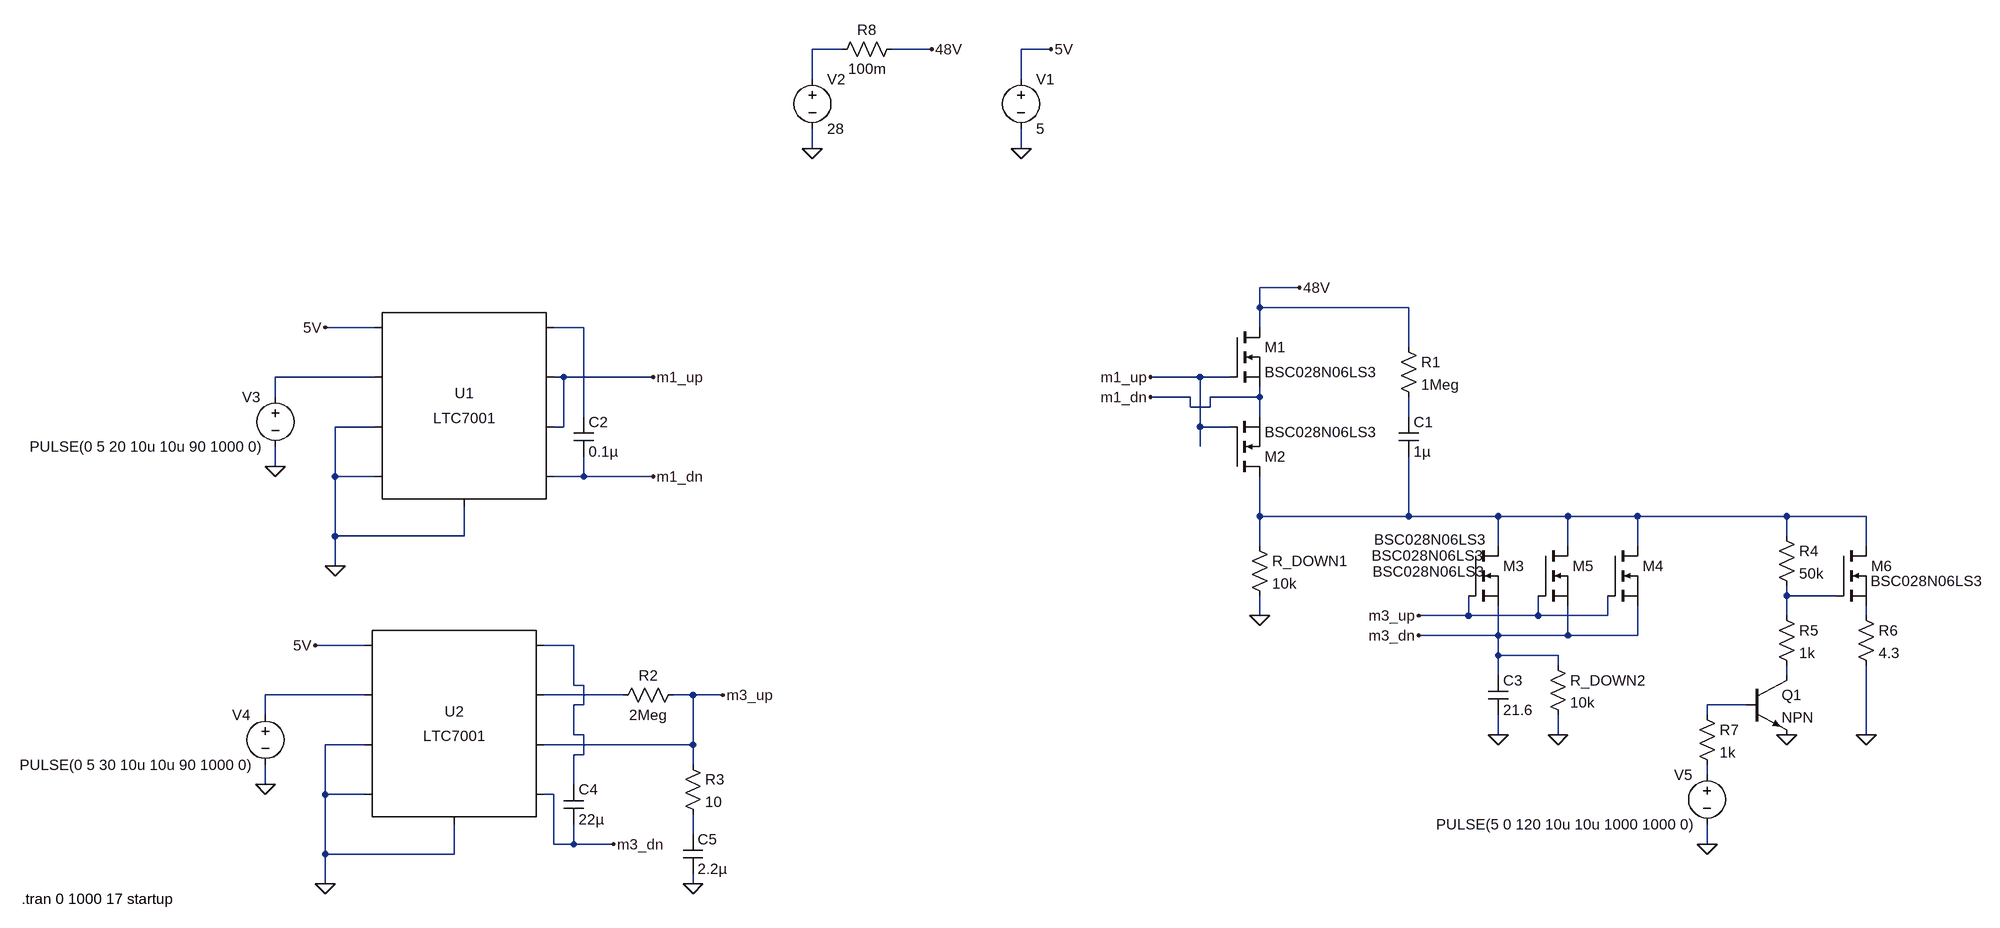
[diagram p0: schematic fet_board_wip.asc]
fet_board_wip.asc, the LTspice schematic file:
Version 4
SHEET 1 1360 1508
WIRE -688 -432 -736 -432
WIRE -544 -432 -608 -432
WIRE -352 -432 -400 -432
WIRE -736 -384 -736 -432
WIRE -400 -384 -400 -432
WIRE -736 -272 -736 -304
WIRE -400 -272 -400 -304
WIRE 48 -48 -16 -48
WIRE -16 -16 -16 -48
WIRE 224 -16 -16 -16
WIRE -1440 16 -1520 16
WIRE -1104 16 -1152 16
WIRE -16 16 -16 -16
WIRE 224 48 224 -16
WIRE -1440 96 -1600 96
WIRE -1136 96 -1152 96
WIRE -992 96 -1136 96
WIRE -112 96 -192 96
WIRE -64 96 -112 96
WIRE -1600 128 -1600 96
WIRE -128 128 -192 128
WIRE -16 128 -16 112
WIRE -16 128 -96 128
WIRE -128 144 -128 128
WIRE -96 144 -96 128
WIRE -96 144 -128 144
WIRE -1104 160 -1104 16
WIRE -16 160 -16 128
WIRE 224 160 224 128
WIRE -1440 176 -1504 176
WIRE -1136 176 -1136 96
WIRE -1136 176 -1152 176
WIRE -112 176 -112 96
WIRE -64 176 -112 176
WIRE -112 208 -112 176
WIRE -1600 240 -1600 208
WIRE -1504 256 -1504 176
WIRE -1440 256 -1504 256
WIRE -1104 256 -1104 224
WIRE -1104 256 -1152 256
WIRE -992 256 -1104 256
WIRE -16 320 -16 256
WIRE 224 320 224 224
WIRE 224 320 -16 320
WIRE 368 320 224 320
WIRE 480 320 368 320
WIRE 592 320 480 320
WIRE 832 320 592 320
WIRE 960 320 832 320
WIRE -1504 352 -1504 256
WIRE -1296 352 -1296 304
WIRE -1296 352 -1504 352
WIRE 832 352 832 320
WIRE -16 368 -16 320
WIRE 368 368 368 320
WIRE 480 368 480 320
WIRE 592 368 592 320
WIRE 960 368 960 320
WIRE -1504 400 -1504 352
WIRE 832 448 832 432
WIRE 912 448 832 448
WIRE -16 480 -16 448
WIRE 320 480 320 448
WIRE 320 480 240 480
WIRE 432 480 432 448
WIRE 432 480 320 480
WIRE 544 480 544 448
WIRE 544 480 432 480
WIRE 832 480 832 448
WIRE 960 480 960 464
WIRE 368 512 368 464
WIRE 368 512 240 512
WIRE 480 512 480 464
WIRE 480 512 368 512
WIRE 592 512 592 464
WIRE 592 512 480 512
WIRE -1456 528 -1536 528
WIRE -1120 528 -1168 528
WIRE 368 544 368 512
WIRE 464 544 368 544
WIRE 464 560 464 544
WIRE 368 576 368 544
WIRE 832 576 832 560
WIRE -1120 592 -1120 528
WIRE -1104 592 -1120 592
WIRE -1456 608 -1616 608
WIRE -1040 608 -1168 608
WIRE -928 608 -960 608
WIRE -880 608 -928 608
WIRE -1104 624 -1104 592
WIRE -1104 624 -1120 624
WIRE 768 624 704 624
WIRE -1616 640 -1616 608
WIRE 704 640 704 624
WIRE -1120 672 -1120 624
WIRE -1104 672 -1120 672
WIRE 368 672 368 640
WIRE 464 672 464 640
WIRE 960 672 960 560
WIRE -1456 688 -1520 688
WIRE -928 688 -928 608
WIRE -928 688 -1168 688
WIRE -1104 704 -1104 672
WIRE -1104 704 -1120 704
WIRE -928 720 -928 688
WIRE 704 736 704 720
WIRE -1616 752 -1616 720
WIRE -1120 752 -1120 704
WIRE -1520 768 -1520 688
WIRE -1456 768 -1520 768
WIRE -1152 768 -1168 768
WIRE -928 832 -928 800
WIRE -1152 848 -1152 768
WIRE -1120 848 -1120 816
WIRE -1120 848 -1152 848
WIRE -1056 848 -1120 848
WIRE 704 848 704 816
WIRE -1520 864 -1520 768
WIRE -1312 864 -1312 816
WIRE -1312 864 -1520 864
WIRE -1520 912 -1520 864
WIRE -928 912 -928 896
FLAG 48 -48 48V
FLAG -400 -272 0
FLAG -352 -432 5V
FLAG -736 -272 0
FLAG -544 -432 48V
FLAG -1520 16 5V
FLAG -1504 400 0
FLAG -1600 240 0
FLAG -16 480 0
FLAG 368 672 0
FLAG -992 96 m1_up
FLAG -992 256 m1_dn
FLAG -192 96 m1_up
FLAG -192 128 m1_dn
FLAG -1536 528 5V
FLAG -1520 912 0
FLAG -1616 752 0
FLAG -880 608 m3_up
FLAG -1056 848 m3_dn
FLAG 240 480 m3_up
FLAG 240 512 m3_dn
FLAG 464 672 0
FLAG -928 912 0
FLAG 960 672 0
FLAG 832 672 0
FLAG 704 848 0
SYMBOL nmos -64 16 R0
SYMATTR InstName M1
SYMATTR Value BSC028N06LS3
SYMBOL nmos -64 256 M180
SYMATTR InstName M2
SYMATTR Value BSC028N06LS3
SYMBOL res 208 32 R0
SYMATTR InstName R1
SYMATTR Value 1Meg
SYMBOL cap 208 160 R0
SYMATTR InstName C1
SYMATTR Value 1µ
SYMBOL voltage -400 -400 R0
WINDOW 123 0 0 Left 0
WINDOW 39 0 0 Left 0
SYMATTR InstName V1
SYMATTR Value 5
SYMBOL voltage -736 -400 R0
WINDOW 123 0 0 Left 0
WINDOW 39 0 0 Left 0
SYMATTR InstName V2
SYMATTR Value 28
SYMBOL PowerProducts\\LTC7001 -1296 144 R0
SYMATTR InstName U1
SYMBOL cap -1120 160 R0
SYMATTR InstName C2
SYMATTR Value 0.1µ
SYMBOL voltage -1600 112 M0
WINDOW 123 0 0 Left 0
WINDOW 39 0 0 Left 0
SYMATTR InstName V3
SYMATTR Value PULSE(0 5 20 10u 10u 90 1000 0)
SYMBOL res -32 352 R0
SYMATTR InstName R_DOWN1
SYMATTR Value 10k
SYMBOL nmos 320 368 R0
WINDOW 3 -152 -11 Left 2
SYMATTR Value BSC028N06LS3
SYMATTR InstName M3
SYMBOL cap 352 576 R0
SYMATTR InstName C3
SYMATTR Value 21.6
SYMBOL PowerProducts\\LTC7001 -1312 656 R0
SYMATTR InstName U2
SYMBOL cap -1136 752 R0
SYMATTR InstName C4
SYMATTR Value 22µ
SYMBOL voltage -1616 624 M0
WINDOW 123 0 0 Left 0
WINDOW 39 0 0 Left 0
SYMATTR InstName V4
SYMATTR Value PULSE(0 5 30 10u 10u 90 1000 0)
SYMBOL res 448 544 R0
SYMATTR InstName R_DOWN2
SYMATTR Value 10k
SYMBOL res -944 592 R90
WINDOW 0 0 56 VBottom 2
WINDOW 3 32 56 VTop 2
SYMATTR InstName R2
SYMATTR Value 2Meg
SYMBOL res -944 704 R0
SYMATTR InstName R3
SYMATTR Value 10
SYMBOL cap -944 832 R0
SYMATTR InstName C5
SYMATTR Value 2.2µ
SYMBOL nmos 432 368 R0
WINDOW 3 -268 15 Left 2
SYMATTR Value BSC028N06LS3
SYMATTR InstName M5
SYMBOL nmos 544 368 R0
WINDOW 3 -378 41 Left 2
SYMATTR Value BSC028N06LS3
SYMATTR InstName M4
SYMBOL res 816 336 R0
SYMATTR InstName R4
SYMATTR Value 50k
SYMBOL res 816 464 R0
SYMATTR InstName R5
SYMATTR Value 1k
SYMBOL nmos 912 368 R0
WINDOW 3 55 56 Left 2
SYMATTR Value BSC028N06LS3
SYMATTR InstName M6
SYMBOL res 944 464 R0
SYMATTR InstName R6
SYMATTR Value 4.3
SYMBOL npn 768 576 R0
SYMATTR InstName Q1
SYMBOL voltage 704 720 M0
WINDOW 123 0 0 Left 0
WINDOW 39 0 0 Left 0
SYMATTR InstName V5
SYMATTR Value PULSE(5 0 120 10u 10u 1000 1000 0)
SYMBOL res 688 624 R0
SYMATTR InstName R7
SYMATTR Value 1k
SYMBOL res -592 -448 R90
WINDOW 0 0 56 VBottom 2
WINDOW 3 32 56 VTop 2
SYMATTR InstName R8
SYMATTR Value 100m
TEXT -2008 936 Left 2 !.tran 0 1000 17 startup

The netlist it stands for:
* fet_board_wip.asc
M1 48V m1_up m1_dn m1_dn BSC028N06LS3
M2 N005 m1_up m1_dn m1_dn BSC028N06LS3
R1 48V N004 1Meg
C1 N004 N005 1µ
V1 5V 0 5
V2 N001 0 28
XU1 5V 0 0 N003 0 m1_up m1_up m1_dn N002 LTC7001
C2 N002 m1_dn 0.1µ
V3 N003 0 PULSE(0 5 20 10u 10u 90 1000 0)
R_DOWN1 N005 0 10k
M3 N005 m3_up m3_dn m3_dn BSC028N06LS3
C3 m3_dn 0 21.6
XU2 5V 0 0 N010 0 m3_up N011 m3_dn N008 LTC7001
C4 N008 m3_dn 22µ
V4 N010 0 PULSE(0 5 30 10u 10u 90 1000 0)
R_DOWN2 m3_dn 0 10k
R2 m3_up N011 2Meg
R3 m3_up N014 10
C5 N014 0 2.2µ
M5 N005 m3_up m3_dn m3_dn BSC028N06LS3
M4 N005 m3_up m3_dn m3_dn BSC028N06LS3
R4 N005 N006 50k
R5 N006 N009 1k
M6 N005 N006 N007 N007 BSC028N06LS3
R6 N007 0 4.3
Q1 N009 N012 0 0 NPN
V5 N013 0 PULSE(5 0 120 10u 10u 1000 1000 0)
R7 N012 N013 1k
R8 48V N001 100m
.model NPN NPN
.model PNP PNP
.lib standard.bjt
.model NMOS NMOS
.model PMOS PMOS
.lib standard.mos
.tran 0 1000 17 startup
.lib LTC7001.sub
.backanno
.end